# EAGLE design gps (EAGLE 5.11)
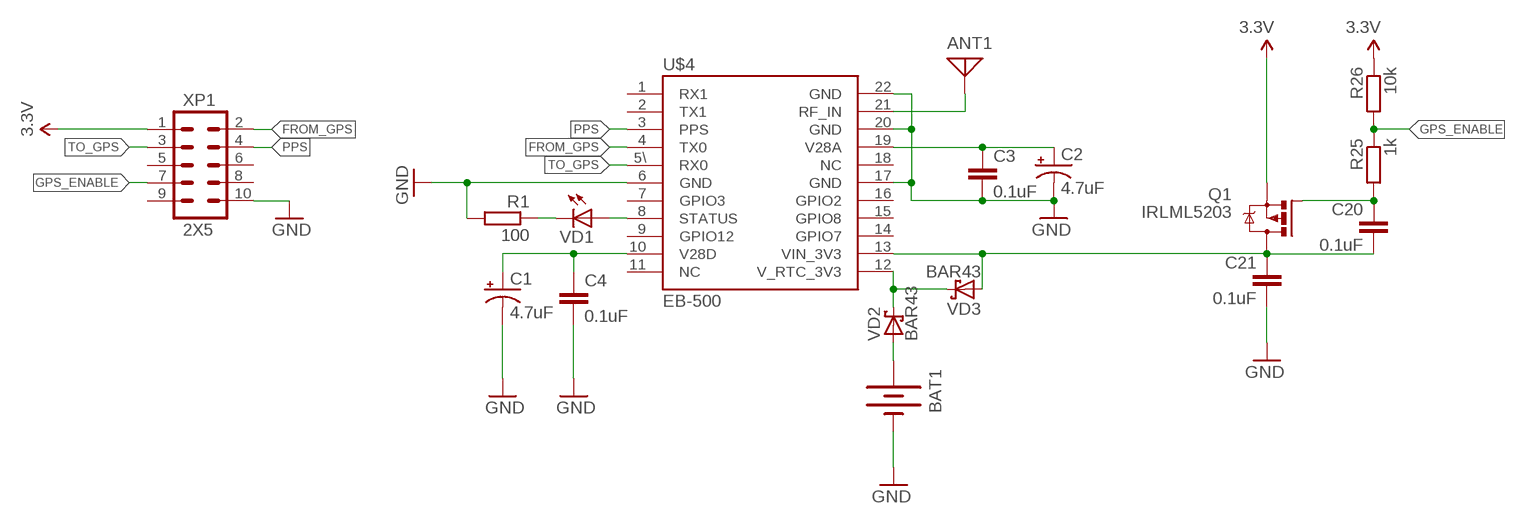
[diagram p0: schematic, sheet 1]

## Parts
ANT1  GPS_ANTENNA  [GPS_ANT]
BAT1  BATTERY12MM  [BATTCON_12MM]
C1  4.7uF  CAP_POL1206-KIT  [EIA3216-KIT]
C2  4.7uF  CAP_POL1206-KIT  [EIA3216-KIT]
C3  0.1uF  CAP0805  [0805]
C4  0.1uF  CAP0805  [0805]
C20  0.1uF  CAP0805  [0805]
C21  0.1uF  CAP0805  [0805]
Q1  IRLML5203  [MICRO3]
R1  100  R-EU_R0805  [R0805]
R25  1k  R-EU_R0805  [R0805]
R26  10k  R-EU_R0805  [R0805]
U$4  EB-500  [EB-500]
VD1  LED0805  [LED-0805]
VD2  BAR43  [SOT23-3]
VD3  BAR43  [SOT23-3]
XP1  2X5  [2X5-PSEUDOSMD]

## Nets
3.3V: Q1.2(S) R26.1 XP1.1
FROM_GPS: U$4.4(TX0) XP1.2
GND: BAT1.GND(-) C1.C(-) C2.C(-) C3.2 C4.2 C21.2 R1.2 U$4.6(GND) U$4.17(GND) U$4.20(GND) U$4.22(GND) XP1.10
GPS_3.3V: C20.2 C21.1 Q1.3(D) U$4.13(VIN_3V3) VD3.1(A)
GPS_ENABLE: R25.1 R26.2 XP1.7
N$1: C1.A(+) C4.1 U$4.10(V28D)
N$2: C2.A(+) C3.1 U$4.19(V28A)
N$3: U$4.8(STATUS) VD1.A
N$4: R1.1 VD1.C
N$5: BAT1.PWR@1(+) VD2.1(A)
N$6: U$4.12(V_RTC_3V3) VD2.3(C) VD3.3(C)
N$7: ANT1.1 U$4.21(RF_IN)
N$21: C20.1 Q1.1(G) R25.2
PPS: U$4.3(PPS) XP1.4
TO_GPS: U$4.5\(RX0) XP1.3
Unconnected: U$4.1(RX1) U$4.2(TX1) U$4.7(GPIO3) U$4.9(GPIO12) U$4.11(NC) U$4.14(GPIO7) U$4.15(GPIO8) U$4.16(GPIO2) U$4.18(NC) XP1.5 XP1.6 XP1.8 XP1.9

## Library data of the parts
ANT1 = barthess:GPS_ANTENNA: GPS passive antenna
BAT1 = SparkFun:BATTERY: Battery Holders Various common sizes : AA, AAA, 20mm coin cell and 12mm coin cell.
C1 C2 = SparkFun:CAP_POL: Capacitor Polarized These are standard SMD and PTH capacitors. Normally 10uF, 47uF, and 100uF in electrolytic and tantalum varieties. Always verify the external diameter of the through hole cap, it varies with capacity, voltage, and manufacturer. The EIA devices should be standard.
C3 C4 C20 C21 = SparkFun:CAP: Capacitor Standard 0603 ceramic capacitor, and 0.1" leaded capacitor.
Q1 = transistor-power:IRLML5203: HEXFET P-Channel Power MOSFET
R1 R25 R26 = rcl:R-EU_: RESISTOR, European symbol
U$4 = barthess:EB-500: GPS receiver
VD1 = barthess:LED: LEDs Standard schematic elements and footprints for 5mm, 3mm, 1206, and 0603 sized LEDs. 5mm - Spark Fun Electronics SKU : COM-00529 (and others)
VD2 VD3 = barthess:BAR43: Silicon Schottky Diodes General-purpose diode
XP1 = barthess:2X5

## Board
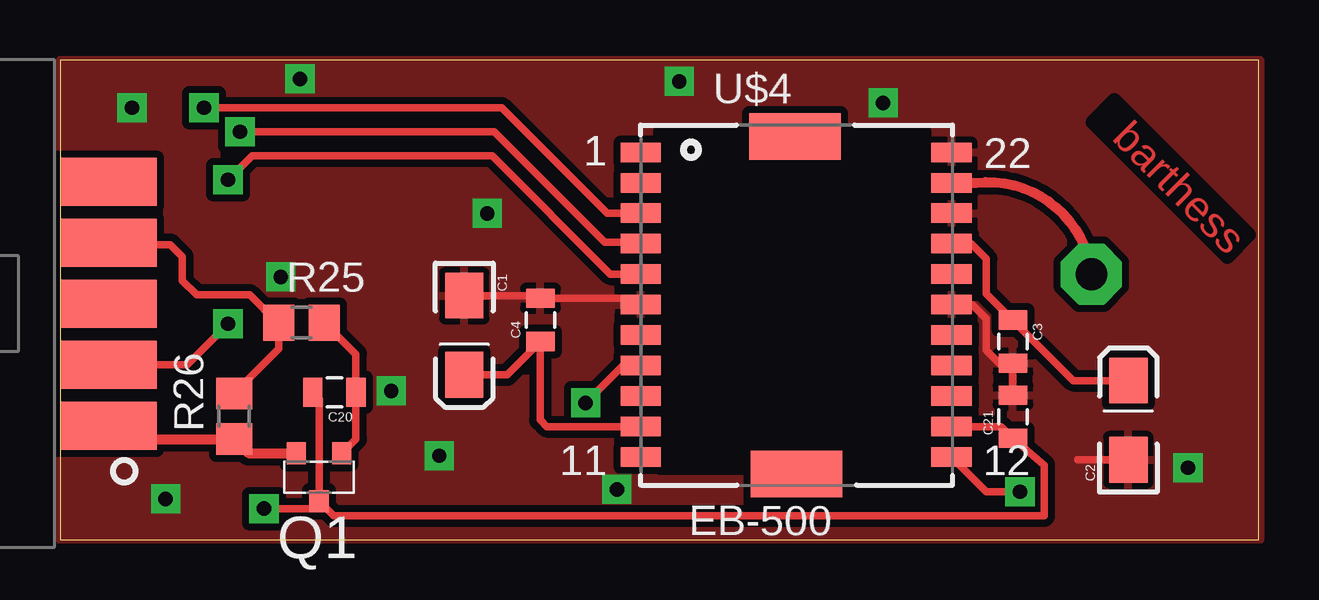
[diagram p1: board, top side]
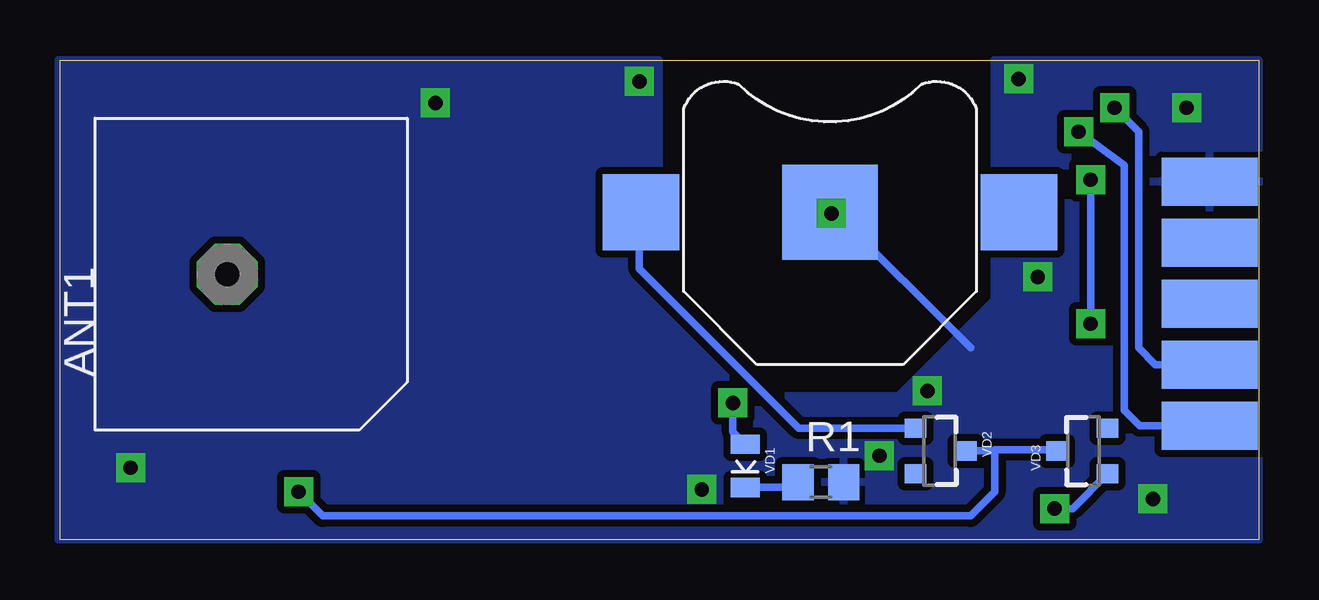
[diagram p2: board, bottom side, seen from below]

Size 49.94 x 19.99 mm. Coordinates in mm from the lower left corner, seen from the top.
Outline: 0,0 49.94,0 49.94,19.99 0,19.99 0,0
Copper layers (1*16): Top 0.035mm / dielectric 1.5mm / Bottom 0.035mm
Design rules "default *": minimum track width 1mm, minimum drill 32mil, track to track 12mil, track to pad 12mil, pad to pad 12mil, via to via 12mil, smd to smd 8mil, copper to edge 0mil, drill to drill 40mil, minimum pad ring 12mil, minimum via ring 12mil, stop-mask expansion 4mil, vias tented up to drill 0mil, thermal gap 10mil
tRestrict: area 25,3 to 36,17

### Footprints (pad centres in the part's own frame; a part is rotated, then mirrored left to right if it is on the bottom)
GPS_ANT = drill 1.321 pad 2.54 octagon: 1 0,0
BATTCON_12MM = smd 3.962 x 3.962: GND 0,0 | smd 3.175 x 3.175: PWR@1 -7.874,0; PWR@2 7.874,0
EIA3216-KIT = smd 1.9 x 1.6: A 1.65,0; C -1.65,0
0805 = smd 0.8 x 1.2: 1 -0.9,0; 2 0.9,0
MICRO3 = smd 0.8 x 0.9: 1 -0.95,-1; 2 0.95,-1; 3 0,1
R0805 = smd 1.3 x 1.5: 1 -0.95,0; 2 0.95,0
EB-500 = smd 1.676 x 0.813: 1 -6.35,6.35; 2 -6.35,5.08; 3 -6.35,3.81; 4 -6.35,2.54; 5\ -6.35,1.27; 6 -6.35,0; 7 -6.35,-1.27; 8 -6.35,-2.54; 9 -6.35,-3.81; 10 -6.35,-5.08; 11 -6.35,-6.35; 12 6.604,-6.35; 13 6.604,-5.08; 14 6.604,-3.81; 15 6.604,-2.54; 16 6.604,-1.27; 17 6.604,0; 18 6.604,1.27; 19 6.604,2.54; 20 6.604,3.81; 21 6.604,5.08; 22 6.604,6.35 | smd 3.81 x 1.93: P$23 0.08,7.005; P$24 0.15,-7.055
LED-0805 = smd 0.8 x 1.2: A -0.9,0; C 0.9,0
SOT23-3 = smd 0.8 x 0.9: 1 -0.95,-1; 2 0.95,-1; 3 0,1.1
2X5-PSEUDOSMD = smd 4 x 2: 1 0,5.08; 3 0,2.54; 5 0,0; 7 0,-2.54; 9 0,-5.08 | smd 4 x 2 bottom: 2 0,5.08; 4 0,2.54; 6 0,0; 8 0,-2.54; 10 0,-5.08

### Placement (x,y rotation side)
ANT1  42.98,11.06 90 bottom
BAT1  17.86,13.65 0 bottom
C1  16.84,8.53 270 top
C2  44.52,4.99 90 top
C3  39.7,8.26 270 top
C4  20.02,9.16 90 top
C20  11.43,6.14 180 top
C21  39.7,5.13 90 top
Q1  10.79,2.6 180 top
R1  18.24,2.4 0 bottom
R25  10.06,9.05 0 top
R26  7.25,5.14 90 top
U$4  30.55,9.79 0 top
VD1  21.39,3.08 270 bottom
VD2  13.3,3.7 270 bottom
VD3  7.3,3.7 90 bottom
XP1  2.04,9.84 180 top

### Tracks (layer width: path | path; a pad name or v marks a point on that pad's centre or on a via)
3.3V
  Top 0.406: XP1.1 3.1,4.2 R26.1 7.84,3.6 Q1.2
FROM_GPS  (via drill 0.6)
  Top 0.305: U$4.4 24.13,12.4 22.7,12.4 18.1,17 v7.5,17
  Bottom 0.305: v7.5,17 5.6,15.6 5.6,5.4 4.96,4.76 XP1.2
GND  (via drill 0.6)
  Top 0.305: 42.4,3.33 C2.C | C21.2 C3.2 39.65,7.3 39.2,7.3 38.6,7.9 38.6,9.2 38.01,9.79 U$4.17 | C1.C 19.91,10.18 C4.2 23.93,10.06 arc-90 U$4.6
  Bottom 0.305: BAT1.GND 17.65,13.65 12,8
  other vias: 3,18 9.2,10.96 47,3 17.8,13.6 34.3,18.2 23.2,2.1 15.8,3.5 10,19.2 4.4,1.7 13.8,6.2 25.8,19.1
  pour Top (isolate 0.305): 0,20 50,20 50,0 0,0
  pour Bottom (isolate 0.305): 0,20 0,0 50,0 50,20 25,20 25,10 21,6 15,6 11,10 11,20
GPS_3.3V  (via drill 0.6)
  Top 0.305: C20.2 10.79,5.88 Q1.3 | Q1.3 10.49,1.3 v8.5,1.3 | Q1.3 11.4,1 41,1 41.01,3.1 C21.1 39.22,4.71 U$4.13
  Bottom 0.305: v8.5,1.3 7.75,1.3 VD3.1
GPS_ENABLE
  Top 0.305: R26.2 9.12,7.96 R25.1 9.05,9.05 7.9,10.2 5.7,10.2 5.1,10.8 5.1,11.8 4.6,12.3 2.62,12.3 XP1.7
N$1
  Top 0.305: C1.A 18.64,6.88 C4.1 20,8.24 20,5 20.29,4.71 U$4.10
N$2
  Top 0.305: U$4.19 37.97,12.34 38.6,11.7 38.6,10.26 C3.1 42.23,6.63 C2.A
N$3  (via drill 0.6)
  Top 0.305: U$4.8 23.45,7.25 v21.9,5.7
  Bottom 0.305: v21.9,5.7 21.9,4.5 VD1.A
N$4
  Bottom 0.305: VD1.C 19.61,2.18 R1.1
N$5
  Bottom 0.305: BAT1.PWR@1 25.8,13.58 25.8,11.3 19.15,4.65 VD2.1
N$6  (via drill 0.6)
  Top 0.305: U$4.12 38.59,2 v40,2
  Bottom 0.305: v40,2 39,1 12,1 11,2 11,3.76 | VD2.3 11.06,3.7 11,3.76 | 11,3.76 8.46,3.76 VD3.3
N$7
  Top 0.406: ANT1.1 arc90 38.16,14.88 U$4.21
N$21
  Top 0.305: R25.2 12.33,7.74 C20.1 12.33,4.19 Q1.1
PPS  (via drill 0.6)
  Top 0.305: U$4.3 22.8,13.6 18.4,18 v6,18
  Bottom 0.305: XP1.4 4.3,7.3 5,8 5,17 v6,18
TO_GPS  (via drill 0.6)
  Top 0.305: U$4.5\ 22.93,11.06 18,16 8,16 v7,15 | v7,9 5.3,7.3 XP1.3
  Bottom 0.305: v7,9 v7,15

### Text on the board
Top: barthess